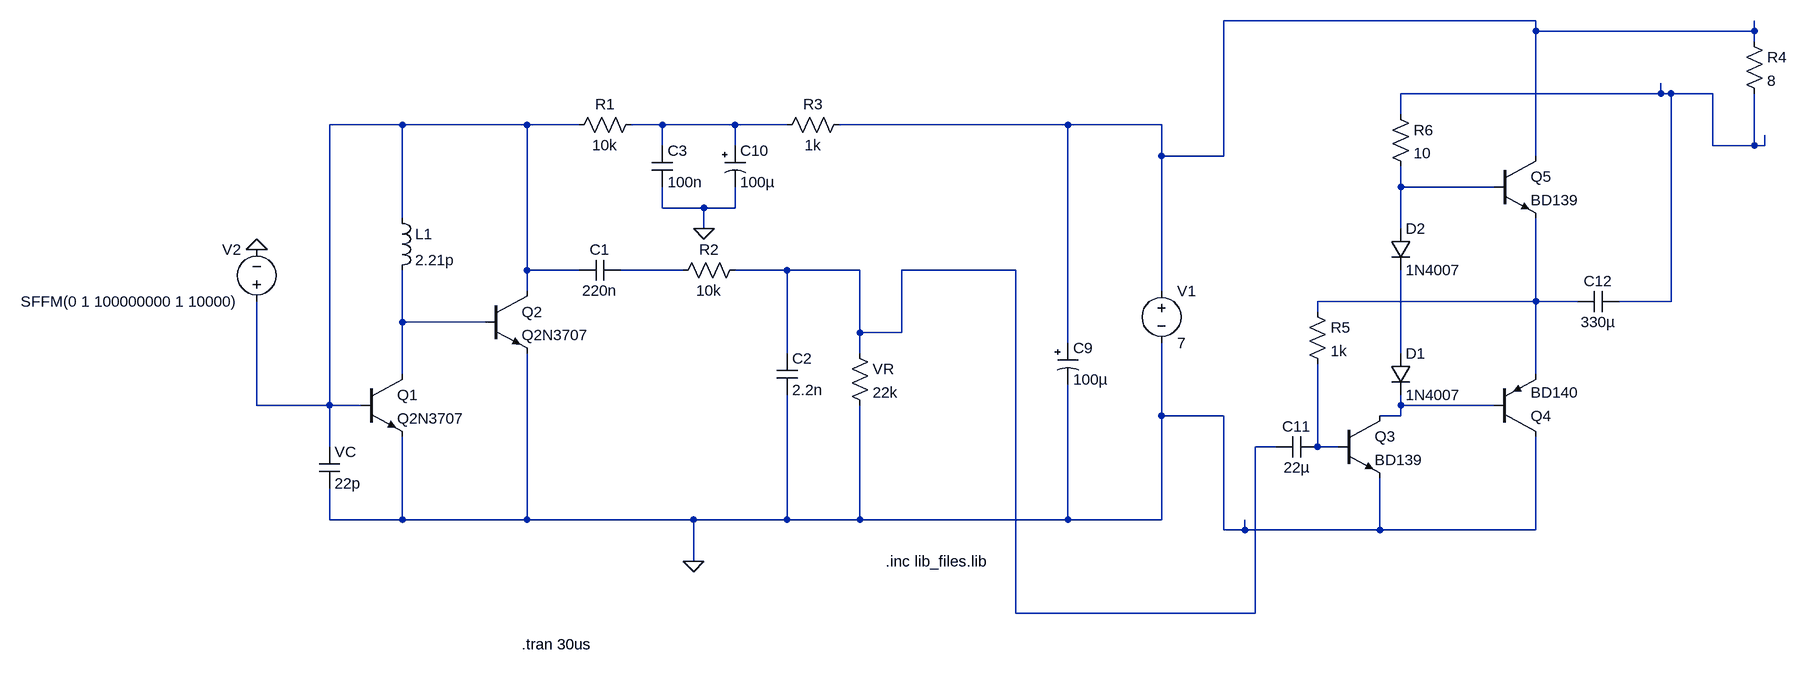
[diagram p0: schematic simulation2_without_ic.asc]
simulation2_without_ic.asc, the LTspice schematic file:
Version 4
SHEET 1 4104 680
WIRE 2432 -448 1952 -448
WIRE 2432 -432 2432 -448
WIRE 2768 -432 2768 -448
WIRE 2768 -432 2432 -432
WIRE 2768 -416 2768 -432
WIRE 2624 -336 2624 -352
WIRE 2624 -336 2224 -336
WIRE 2640 -336 2624 -336
WIRE 2704 -336 2640 -336
WIRE 2224 -304 2224 -336
WIRE 688 -288 576 -288
WIRE 880 -288 688 -288
WIRE 960 -288 880 -288
WIRE 1088 -288 1040 -288
WIRE 1200 -288 1088 -288
WIRE 1280 -288 1200 -288
WIRE 1712 -288 1360 -288
WIRE 1856 -288 1712 -288
WIRE 1088 -256 1088 -288
WIRE 1200 -256 1200 -288
WIRE 2704 -256 2704 -336
WIRE 2768 -256 2768 -336
WIRE 2768 -256 2704 -256
WIRE 2784 -256 2784 -272
WIRE 2784 -256 2768 -256
WIRE 1856 -240 1856 -288
WIRE 1952 -240 1952 -448
WIRE 1952 -240 1856 -240
WIRE 2432 -240 2432 -432
WIRE 2224 -192 2224 -224
WIRE 2368 -192 2224 -192
WIRE 1088 -160 1088 -192
WIRE 1152 -160 1088 -160
WIRE 1200 -160 1200 -192
WIRE 1200 -160 1152 -160
WIRE 688 -144 688 -288
WIRE 1152 -128 1152 -160
WIRE 2224 -128 2224 -192
WIRE 880 -64 880 -288
WIRE 960 -64 880 -64
WIRE 1120 -64 1024 -64
WIRE 1280 -64 1200 -64
WIRE 1392 -64 1280 -64
WIRE 1632 -64 1456 -64
WIRE 880 -32 880 -64
WIRE 1856 -32 1856 -240
WIRE 2432 -16 2432 -144
WIRE 2432 -16 2096 -16
WIRE 2496 -16 2432 -16
WIRE 2640 -16 2640 -336
WIRE 2640 -16 2560 -16
WIRE 2096 0 2096 -16
WIRE 688 16 688 -64
WIRE 816 16 688 16
WIRE 1392 32 1392 -64
WIRE 1456 32 1456 -64
WIRE 1456 32 1392 32
WIRE 1712 48 1712 -288
WIRE 1280 64 1280 -64
WIRE 1392 64 1392 32
WIRE 2224 64 2224 -64
WIRE 688 96 688 16
WIRE 2432 96 2432 -16
WIRE 464 144 464 -16
WIRE 576 144 576 -288
WIRE 576 144 464 144
WIRE 624 144 576 144
WIRE 2224 144 2224 128
WIRE 2368 144 2224 144
WIRE 1856 160 1856 48
WIRE 1952 160 1856 160
WIRE 2224 160 2224 144
WIRE 2224 160 2192 160
WIRE 576 208 576 144
WIRE 2032 208 2000 208
WIRE 2096 208 2096 80
WIRE 2128 208 2096 208
WIRE 576 320 576 272
WIRE 688 320 688 192
WIRE 688 320 576 320
WIRE 880 320 880 64
WIRE 880 320 688 320
WIRE 1136 320 880 320
WIRE 1280 320 1280 128
WIRE 1280 320 1136 320
WIRE 1392 320 1392 144
WIRE 1392 320 1280 320
WIRE 1712 320 1712 112
WIRE 1712 320 1392 320
WIRE 1856 320 1856 160
WIRE 1856 320 1712 320
WIRE 1952 336 1952 160
WIRE 1984 336 1984 320
WIRE 1984 336 1952 336
WIRE 2192 336 2192 256
WIRE 2192 336 1984 336
WIRE 2432 336 2432 192
WIRE 2432 336 2192 336
WIRE 1136 384 1136 320
WIRE 1632 464 1632 -64
WIRE 2000 464 2000 208
WIRE 2000 464 1632 464
FLAG 1152 -128 0
FLAG 464 -96 0
FLAG 1136 384 0
SYMBOL cap 560 208 R0
SYMATTR InstName VC
SYMATTR Value 22p
SYMBOL npn 624 96 R0
SYMATTR InstName Q1
SYMATTR Value Q2N3707
SYMBOL ind 672 -160 R0
SYMATTR InstName L1
SYMATTR Value 2.21p
SYMBOL res 1056 -304 R90
WINDOW 0 0 56 VBottom 2
WINDOW 3 32 56 VTop 2
SYMATTR InstName R1
SYMATTR Value 10k
SYMBOL cap 1072 -256 R0
SYMATTR InstName C3
SYMATTR Value 100n
SYMBOL polcap 1184 -256 R0
SYMATTR InstName C10
SYMATTR Value 100µ
SYMBOL cap 960 -48 R270
WINDOW 0 32 32 VTop 2
WINDOW 3 0 32 VBottom 2
SYMATTR InstName C1
SYMATTR Value 220n
SYMBOL res 1216 -80 R90
WINDOW 0 0 56 VBottom 2
WINDOW 3 32 56 VTop 2
SYMATTR InstName R2
SYMATTR Value 10k
SYMBOL cap 1264 64 R0
SYMATTR InstName C2
SYMATTR Value 2.2n
SYMBOL res 1376 48 R0
SYMATTR InstName VR
SYMATTR Value 22k
SYMBOL res 1376 -304 R90
WINDOW 0 0 56 VBottom 2
WINDOW 3 32 56 VTop 2
SYMATTR InstName R3
SYMATTR Value 1k
SYMBOL npn 816 -32 R0
SYMATTR InstName Q2
SYMATTR Value Q2N3707
SYMBOL polcap 1696 48 R0
SYMATTR InstName C9
SYMATTR Value 100µ
SYMBOL voltage 1856 -48 R0
WINDOW 123 0 0 Left 0
WINDOW 39 0 0 Left 0
SYMATTR InstName V1
SYMATTR Value 7
SYMBOL voltage 464 0 R180
WINDOW 0 24 96 Left 2
WINDOW 3 24 16 Left 2
WINDOW 123 0 0 Left 0
WINDOW 39 0 0 Left 0
SYMATTR InstName V2
SYMATTR Value SFFM(0 1 100000000 1 10000)
SYMBOL cap 2096 192 R90
WINDOW 0 0 32 VBottom 2
WINDOW 3 32 32 VTop 2
SYMATTR InstName C11
SYMATTR Value 22µ
SYMBOL res 2080 -16 R0
SYMATTR InstName R5
SYMATTR Value 1k
SYMBOL diode 2208 64 R0
SYMATTR InstName D1
SYMATTR Value 1N4007
SYMBOL diode 2208 -128 R0
SYMATTR InstName D2
SYMATTR Value 1N4007
SYMBOL npn 2128 160 R0
SYMATTR InstName Q3
SYMATTR Value BD139
SYMBOL pnp 2368 192 M180
SYMATTR InstName Q4
SYMATTR Value BD140
SYMBOL cap 2560 -32 R90
WINDOW 0 0 32 VBottom 2
WINDOW 3 32 32 VTop 2
SYMATTR InstName C12
SYMATTR Value 330µ
SYMBOL res 2208 -320 R0
SYMATTR InstName R6
SYMATTR Value 10
SYMBOL npn 2368 -240 R0
SYMATTR InstName Q5
SYMATTR Value BD139
SYMBOL res 2752 -432 R0
SYMATTR InstName R4
SYMATTR Value 8
TEXT 1432 384 Left 2 !.inc lib_files.lib
TEXT 872 512 Left 2 !.tran 30us

The netlist it stands for:
* simulation2_without_ic.asc
C§VC N003 0 22p
Q1 N009 N003 0 0 Q2N3707
L1 N003 N009 2.21p
R1 N004 N003 10k
C3 N004 0 100n
C10 N004 0 100µ
C1 N003 N006 220n
R2 N007 N006 10k
C2 N007 0 2.2n
R§VR N007 0 22k
R3 N001 N004 1k
Q2 N003 N009 0 0 Q2N3707
C9 N001 0 100µ
V1 N001 0 7
V2 N003 0 SFFM(0 1 100000000 1 10000)
C11 N012 N007 22µ
R5 N008 N012 1k
D1 N010 N011 1N4007
D2 N005 N010 1N4007
Q3 N011 N012 0 0 BD139
Q4 0 N011 N008 0 BD140
C12 N002 N008 330µ
R6 N002 N005 10
Q5 N001 N005 N008 0 BD139
R4 N001 N002 8
.model D D
.lib standard.dio
.model NPN NPN
.model PNP PNP
.lib standard.bjt
.inc lib_files.lib
.tran 30us
.backanno
.end